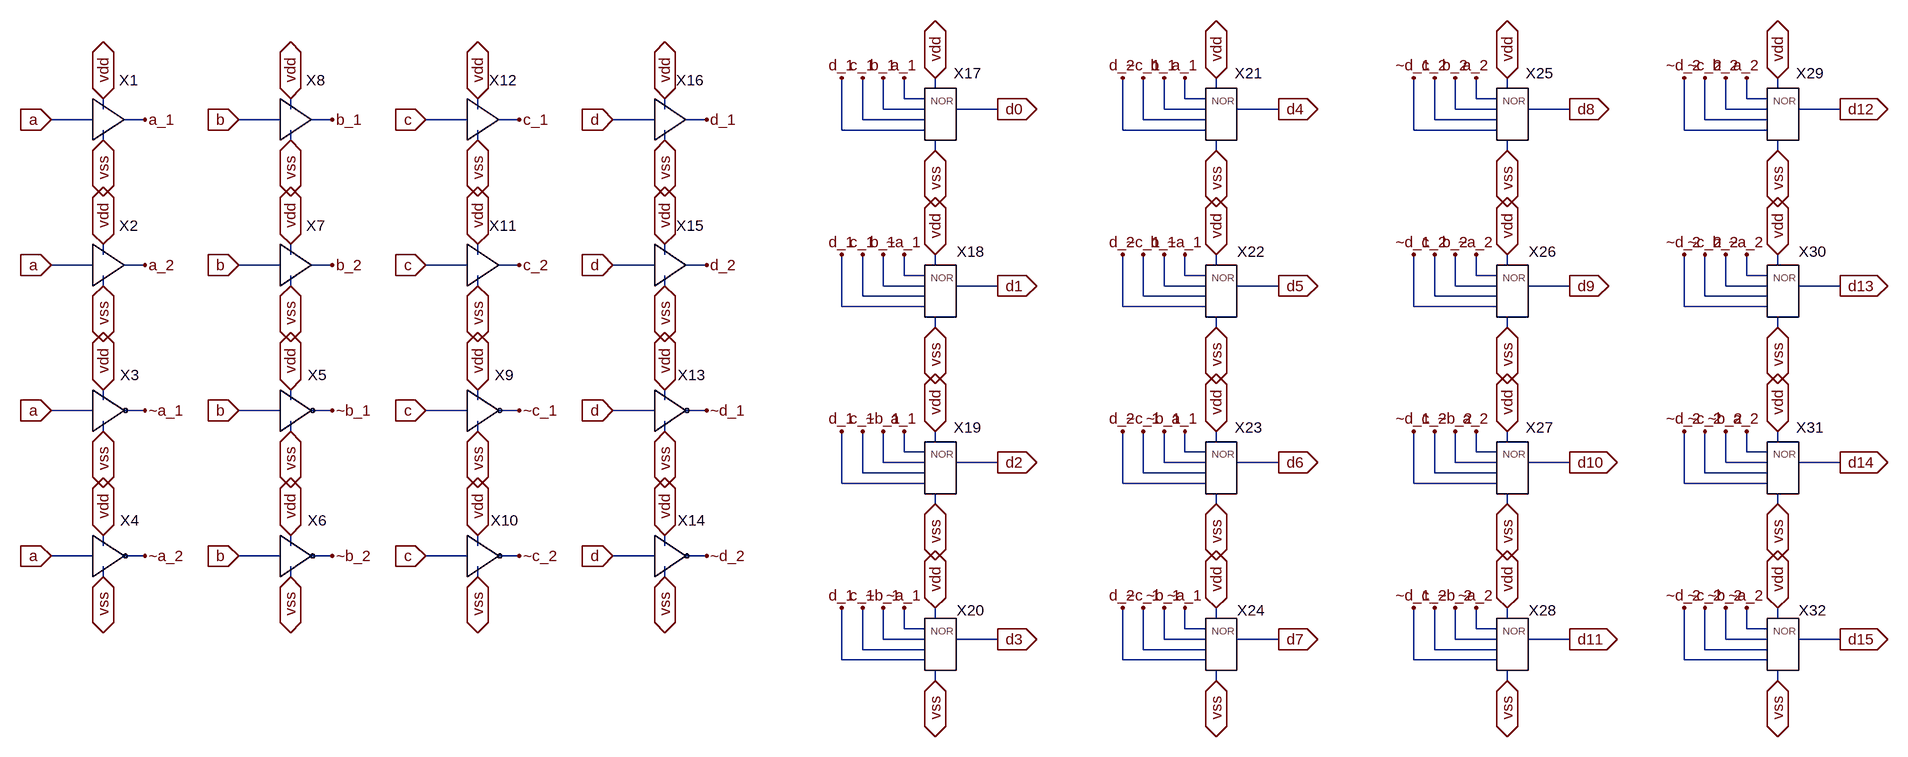
[diagram p0: schematic 4_to_16_decoder.asc]
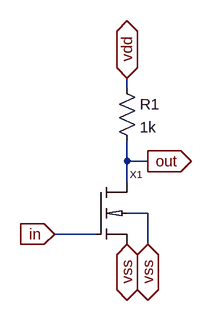
[diagram p1: sub-circuit not.asc]
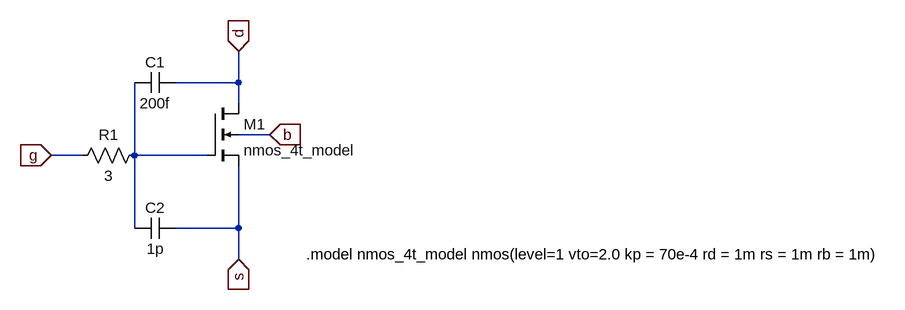
[diagram p2: sub-circuit nmos_4t.asc]
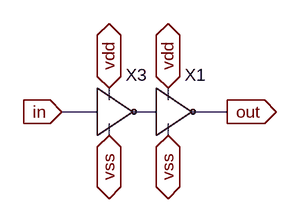
[diagram p3: sub-circuit buffer.asc]
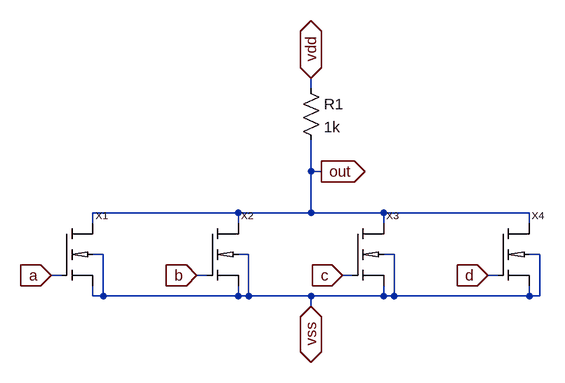
[diagram p4: sub-circuit 4_way_nor.asc]
4_to_16_decoder.asc, the LTspice schematic file:
Version 4
SHEET 1 3944 3300
WIRE 1824 -384 1824 -400
WIRE 2256 -384 2256 -400
WIRE 2704 -384 2704 -400
WIRE 3120 -384 3120 -400
WIRE 1776 -368 1776 -400
WIRE 1808 -368 1776 -368
WIRE 2208 -368 2208 -400
WIRE 2240 -368 2208 -368
WIRE 2656 -368 2656 -400
WIRE 2688 -368 2656 -368
WIRE 3072 -368 3072 -400
WIRE 3104 -368 3072 -368
WIRE 544 -352 544 -368
WIRE 832 -352 832 -368
WIRE 1120 -352 1120 -368
WIRE 1408 -352 1408 -368
WIRE 1744 -352 1744 -400
WIRE 1808 -352 1744 -352
WIRE 1920 -352 1856 -352
WIRE 2176 -352 2176 -400
WIRE 2240 -352 2176 -352
WIRE 2352 -352 2288 -352
WIRE 2624 -352 2624 -400
WIRE 2688 -352 2624 -352
WIRE 2800 -352 2736 -352
WIRE 3040 -352 3040 -400
WIRE 3104 -352 3040 -352
WIRE 3216 -352 3152 -352
WIRE 528 -336 464 -336
WIRE 608 -336 576 -336
WIRE 816 -336 752 -336
WIRE 896 -336 864 -336
WIRE 1104 -336 1040 -336
WIRE 1184 -336 1152 -336
WIRE 1392 -336 1328 -336
WIRE 1472 -336 1440 -336
WIRE 1712 -336 1712 -400
WIRE 1808 -336 1712 -336
WIRE 2144 -336 2144 -400
WIRE 2240 -336 2144 -336
WIRE 2592 -336 2592 -400
WIRE 2688 -336 2592 -336
WIRE 3008 -336 3008 -400
WIRE 3104 -336 3008 -336
WIRE 1680 -320 1680 -400
WIRE 1808 -320 1680 -320
WIRE 2112 -320 2112 -400
WIRE 2240 -320 2112 -320
WIRE 2560 -320 2560 -400
WIRE 2688 -320 2560 -320
WIRE 2976 -320 2976 -400
WIRE 3104 -320 2976 -320
WIRE 544 -304 544 -320
WIRE 832 -304 832 -320
WIRE 1120 -304 1120 -320
WIRE 1408 -304 1408 -320
WIRE 1824 -288 1824 -304
WIRE 2256 -288 2256 -304
WIRE 2704 -288 2704 -304
WIRE 3120 -288 3120 -304
WIRE 544 -128 544 -144
WIRE 832 -128 832 -144
WIRE 1120 -128 1120 -144
WIRE 1408 -128 1408 -144
WIRE 528 -112 464 -112
WIRE 608 -112 576 -112
WIRE 816 -112 752 -112
WIRE 896 -112 864 -112
WIRE 1104 -112 1040 -112
WIRE 1184 -112 1152 -112
WIRE 1392 -112 1328 -112
WIRE 1472 -112 1440 -112
WIRE 1824 -112 1824 -128
WIRE 2256 -112 2256 -128
WIRE 2704 -112 2704 -128
WIRE 3120 -112 3120 -128
WIRE 1776 -96 1776 -128
WIRE 1808 -96 1776 -96
WIRE 2208 -96 2208 -128
WIRE 2240 -96 2208 -96
WIRE 2656 -96 2656 -128
WIRE 2688 -96 2656 -96
WIRE 3072 -96 3072 -128
WIRE 3104 -96 3072 -96
WIRE 544 -80 544 -96
WIRE 832 -80 832 -96
WIRE 1120 -80 1120 -96
WIRE 1408 -80 1408 -96
WIRE 1744 -80 1744 -128
WIRE 1808 -80 1744 -80
WIRE 1920 -80 1856 -80
WIRE 2176 -80 2176 -128
WIRE 2240 -80 2176 -80
WIRE 2352 -80 2288 -80
WIRE 2624 -80 2624 -128
WIRE 2688 -80 2624 -80
WIRE 2800 -80 2736 -80
WIRE 3040 -80 3040 -128
WIRE 3104 -80 3040 -80
WIRE 3216 -80 3152 -80
WIRE 1712 -64 1712 -128
WIRE 1808 -64 1712 -64
WIRE 2144 -64 2144 -128
WIRE 2240 -64 2144 -64
WIRE 2592 -64 2592 -128
WIRE 2688 -64 2592 -64
WIRE 3008 -64 3008 -128
WIRE 3104 -64 3008 -64
WIRE 1680 -48 1680 -128
WIRE 1808 -48 1680 -48
WIRE 2112 -48 2112 -128
WIRE 2240 -48 2112 -48
WIRE 2560 -48 2560 -128
WIRE 2688 -48 2560 -48
WIRE 2976 -48 2976 -128
WIRE 3104 -48 2976 -48
WIRE 1824 -16 1824 -32
WIRE 2256 -16 2256 -32
WIRE 2704 -16 2704 -32
WIRE 3120 -16 3120 -32
WIRE 544 96 544 80
WIRE 832 96 832 80
WIRE 1120 96 1120 80
WIRE 1408 96 1408 80
WIRE 528 112 464 112
WIRE 608 112 576 112
WIRE 816 112 752 112
WIRE 896 112 864 112
WIRE 1104 112 1040 112
WIRE 1184 112 1152 112
WIRE 1392 112 1328 112
WIRE 1472 112 1440 112
WIRE 544 144 544 128
WIRE 832 144 832 128
WIRE 1120 144 1120 128
WIRE 1408 144 1408 128
WIRE 1824 160 1824 144
WIRE 2256 160 2256 144
WIRE 2704 160 2704 144
WIRE 3120 160 3120 144
WIRE 1776 176 1776 144
WIRE 1808 176 1776 176
WIRE 2208 176 2208 144
WIRE 2240 176 2208 176
WIRE 2656 176 2656 144
WIRE 2688 176 2656 176
WIRE 3072 176 3072 144
WIRE 3104 176 3072 176
WIRE 1744 192 1744 144
WIRE 1808 192 1744 192
WIRE 1920 192 1856 192
WIRE 2176 192 2176 144
WIRE 2240 192 2176 192
WIRE 2352 192 2288 192
WIRE 2624 192 2624 144
WIRE 2688 192 2624 192
WIRE 2800 192 2736 192
WIRE 3040 192 3040 144
WIRE 3104 192 3040 192
WIRE 3216 192 3152 192
WIRE 1712 208 1712 144
WIRE 1808 208 1712 208
WIRE 2144 208 2144 144
WIRE 2240 208 2144 208
WIRE 2592 208 2592 144
WIRE 2688 208 2592 208
WIRE 3008 208 3008 144
WIRE 3104 208 3008 208
WIRE 1680 224 1680 144
WIRE 1808 224 1680 224
WIRE 2112 224 2112 144
WIRE 2240 224 2112 224
WIRE 2560 224 2560 144
WIRE 2688 224 2560 224
WIRE 2976 224 2976 144
WIRE 3104 224 2976 224
WIRE 1824 256 1824 240
WIRE 2256 256 2256 240
WIRE 2704 256 2704 240
WIRE 3120 256 3120 240
WIRE 544 320 544 304
WIRE 832 320 832 304
WIRE 1120 320 1120 304
WIRE 1408 320 1408 304
WIRE 528 336 464 336
WIRE 608 336 576 336
WIRE 816 336 752 336
WIRE 896 336 864 336
WIRE 1104 336 1040 336
WIRE 1184 336 1152 336
WIRE 1392 336 1328 336
WIRE 1472 336 1440 336
WIRE 544 368 544 352
WIRE 832 368 832 352
WIRE 1120 368 1120 352
WIRE 1408 368 1408 352
WIRE 1824 432 1824 416
WIRE 2256 432 2256 416
WIRE 2704 432 2704 416
WIRE 3120 432 3120 416
WIRE 1776 448 1776 416
WIRE 1808 448 1776 448
WIRE 2208 448 2208 416
WIRE 2240 448 2208 448
WIRE 2656 448 2656 416
WIRE 2688 448 2656 448
WIRE 3072 448 3072 416
WIRE 3104 448 3072 448
WIRE 1744 464 1744 416
WIRE 1808 464 1744 464
WIRE 1920 464 1856 464
WIRE 2176 464 2176 416
WIRE 2240 464 2176 464
WIRE 2352 464 2288 464
WIRE 2624 464 2624 416
WIRE 2688 464 2624 464
WIRE 2800 464 2736 464
WIRE 3040 464 3040 416
WIRE 3104 464 3040 464
WIRE 3216 464 3152 464
WIRE 1712 480 1712 416
WIRE 1808 480 1712 480
WIRE 2144 480 2144 416
WIRE 2240 480 2144 480
WIRE 2592 480 2592 416
WIRE 2688 480 2592 480
WIRE 3008 480 3008 416
WIRE 3104 480 3008 480
WIRE 1680 496 1680 416
WIRE 1808 496 1680 496
WIRE 2112 496 2112 416
WIRE 2240 496 2112 496
WIRE 2560 496 2560 416
WIRE 2688 496 2560 496
WIRE 2976 496 2976 416
WIRE 3104 496 2976 496
WIRE 1824 528 1824 512
WIRE 2256 528 2256 512
WIRE 2704 528 2704 512
WIRE 3120 528 3120 512
FLAG 464 112 a
IOPIN 464 112 In
FLAG 544 80 vdd
IOPIN 544 80 BiDir
FLAG 544 144 vss
IOPIN 544 144 BiDir
FLAG 608 112 ~a_1
FLAG 464 336 a
IOPIN 464 336 In
FLAG 544 304 vdd
IOPIN 544 304 BiDir
FLAG 544 368 vss
IOPIN 544 368 BiDir
FLAG 608 336 ~a_2
FLAG 464 -112 a
IOPIN 464 -112 In
FLAG 544 -144 vdd
IOPIN 544 -144 BiDir
FLAG 544 -80 vss
IOPIN 544 -80 BiDir
FLAG 608 -112 a_2
FLAG 464 -336 a
IOPIN 464 -336 In
FLAG 544 -368 vdd
IOPIN 544 -368 BiDir
FLAG 544 -304 vss
IOPIN 544 -304 BiDir
FLAG 608 -336 a_1
FLAG 832 80 vdd
IOPIN 832 80 BiDir
FLAG 832 144 vss
IOPIN 832 144 BiDir
FLAG 896 112 ~b_1
FLAG 832 304 vdd
IOPIN 832 304 BiDir
FLAG 832 368 vss
IOPIN 832 368 BiDir
FLAG 896 336 ~b_2
FLAG 832 -144 vdd
IOPIN 832 -144 BiDir
FLAG 832 -80 vss
IOPIN 832 -80 BiDir
FLAG 896 -112 b_2
FLAG 752 -336 b
IOPIN 752 -336 In
FLAG 832 -368 vdd
IOPIN 832 -368 BiDir
FLAG 832 -304 vss
IOPIN 832 -304 BiDir
FLAG 896 -336 b_1
FLAG 752 -112 b
IOPIN 752 -112 In
FLAG 752 112 b
IOPIN 752 112 In
FLAG 752 336 b
IOPIN 752 336 In
FLAG 1120 80 vdd
IOPIN 1120 80 BiDir
FLAG 1120 144 vss
IOPIN 1120 144 BiDir
FLAG 1184 112 ~c_1
FLAG 1120 304 vdd
IOPIN 1120 304 BiDir
FLAG 1120 368 vss
IOPIN 1120 368 BiDir
FLAG 1184 336 ~c_2
FLAG 1120 -144 vdd
IOPIN 1120 -144 BiDir
FLAG 1120 -80 vss
IOPIN 1120 -80 BiDir
FLAG 1184 -112 c_2
FLAG 1040 -336 c
IOPIN 1040 -336 In
FLAG 1120 -368 vdd
IOPIN 1120 -368 BiDir
FLAG 1120 -304 vss
IOPIN 1120 -304 BiDir
FLAG 1184 -336 c_1
FLAG 1040 -112 c
IOPIN 1040 -112 In
FLAG 1040 112 c
IOPIN 1040 112 In
FLAG 1040 336 c
IOPIN 1040 336 In
FLAG 1408 80 vdd
IOPIN 1408 80 BiDir
FLAG 1408 144 vss
IOPIN 1408 144 BiDir
FLAG 1472 112 ~d_1
FLAG 1408 304 vdd
IOPIN 1408 304 BiDir
FLAG 1408 368 vss
IOPIN 1408 368 BiDir
FLAG 1472 336 ~d_2
FLAG 1408 -144 vdd
IOPIN 1408 -144 BiDir
FLAG 1408 -80 vss
IOPIN 1408 -80 BiDir
FLAG 1472 -112 d_2
FLAG 1328 -336 d
IOPIN 1328 -336 In
FLAG 1408 -368 vdd
IOPIN 1408 -368 BiDir
FLAG 1408 -304 vss
IOPIN 1408 -304 BiDir
FLAG 1472 -336 d_1
FLAG 1328 -112 d
IOPIN 1328 -112 In
FLAG 1328 112 d
IOPIN 1328 112 In
FLAG 1328 336 d
IOPIN 1328 336 In
FLAG 1920 -352 d0
IOPIN 1920 -352 Out
FLAG 1920 -80 d1
IOPIN 1920 -80 Out
FLAG 1920 464 d3
IOPIN 1920 464 Out
FLAG 1920 192 d2
IOPIN 1920 192 Out
FLAG 2352 -352 d4
IOPIN 2352 -352 Out
FLAG 2352 -80 d5
IOPIN 2352 -80 Out
FLAG 2352 192 d6
IOPIN 2352 192 Out
FLAG 2352 464 d7
IOPIN 2352 464 Out
FLAG 2800 -352 d8
IOPIN 2800 -352 Out
FLAG 2800 -80 d9
IOPIN 2800 -80 Out
FLAG 2800 192 d10
IOPIN 2800 192 Out
FLAG 2800 464 d11
IOPIN 2800 464 Out
FLAG 3216 -352 d12
IOPIN 3216 -352 Out
FLAG 3216 -80 d13
IOPIN 3216 -80 Out
FLAG 3216 192 d14
IOPIN 3216 192 Out
FLAG 3216 464 d15
IOPIN 3216 464 Out
FLAG 1824 -288 vss
IOPIN 1824 -288 BiDir
FLAG 1824 144 vdd
IOPIN 1824 144 BiDir
FLAG 1824 256 vss
IOPIN 1824 256 BiDir
FLAG 1824 416 vdd
IOPIN 1824 416 BiDir
FLAG 1824 528 vss
IOPIN 1824 528 BiDir
FLAG 1824 -400 vdd
IOPIN 1824 -400 BiDir
FLAG 1776 -400 a_1
FLAG 1744 -400 b_1
FLAG 1712 -400 c_1
FLAG 1680 -400 d_1
FLAG 1824 -16 vss
IOPIN 1824 -16 BiDir
FLAG 1824 -128 vdd
IOPIN 1824 -128 BiDir
FLAG 1776 -128 ~a_1
FLAG 1744 -128 b_1
FLAG 1712 -128 c_1
FLAG 1680 -128 d_1
FLAG 1776 144 a_1
FLAG 1744 144 ~b_1
FLAG 1712 144 c_1
FLAG 1680 144 d_1
FLAG 1776 416 ~a_1
FLAG 1744 416 ~b_1
FLAG 1712 416 c_1
FLAG 1680 416 d_1
FLAG 2256 -288 vss
IOPIN 2256 -288 BiDir
FLAG 2256 144 vdd
IOPIN 2256 144 BiDir
FLAG 2256 256 vss
IOPIN 2256 256 BiDir
FLAG 2256 416 vdd
IOPIN 2256 416 BiDir
FLAG 2256 528 vss
IOPIN 2256 528 BiDir
FLAG 2256 -400 vdd
IOPIN 2256 -400 BiDir
FLAG 2208 -400 a_1
FLAG 2176 -400 b_1
FLAG 2144 -400 ~c_1
FLAG 2112 -400 d_2
FLAG 2256 -16 vss
IOPIN 2256 -16 BiDir
FLAG 2256 -128 vdd
IOPIN 2256 -128 BiDir
FLAG 2208 -128 ~a_1
FLAG 2176 -128 b_1
FLAG 2144 -128 ~c_1
FLAG 2112 -128 d_2
FLAG 2208 144 a_1
FLAG 2176 144 ~b_1
FLAG 2144 144 ~c_1
FLAG 2112 144 d_2
FLAG 2208 416 ~a_1
FLAG 2176 416 ~b_1
FLAG 2144 416 ~c_1
FLAG 2112 416 d_2
FLAG 2704 -288 vss
IOPIN 2704 -288 BiDir
FLAG 2704 144 vdd
IOPIN 2704 144 BiDir
FLAG 2704 256 vss
IOPIN 2704 256 BiDir
FLAG 2704 416 vdd
IOPIN 2704 416 BiDir
FLAG 2704 528 vss
IOPIN 2704 528 BiDir
FLAG 2704 -400 vdd
IOPIN 2704 -400 BiDir
FLAG 2656 -400 a_2
FLAG 2624 -400 b_2
FLAG 2592 -400 c_2
FLAG 2560 -400 ~d_1
FLAG 2704 -16 vss
IOPIN 2704 -16 BiDir
FLAG 2704 -128 vdd
IOPIN 2704 -128 BiDir
FLAG 3120 -288 vss
IOPIN 3120 -288 BiDir
FLAG 3120 144 vdd
IOPIN 3120 144 BiDir
FLAG 3120 256 vss
IOPIN 3120 256 BiDir
FLAG 3120 416 vdd
IOPIN 3120 416 BiDir
FLAG 3120 528 vss
IOPIN 3120 528 BiDir
FLAG 3120 -400 vdd
IOPIN 3120 -400 BiDir
FLAG 3120 -16 vss
IOPIN 3120 -16 BiDir
FLAG 3120 -128 vdd
IOPIN 3120 -128 BiDir
FLAG 2656 -128 ~a_2
FLAG 2624 -128 b_2
FLAG 2592 -128 c_2
FLAG 2560 -128 ~d_1
FLAG 2656 144 a_2
FLAG 2624 144 ~b_2
FLAG 2592 144 c_2
FLAG 2560 144 ~d_1
FLAG 2656 416 ~a_2
FLAG 2624 416 ~b_2
FLAG 2592 416 c_2
FLAG 2560 416 ~d_1
FLAG 3072 -400 a_2
FLAG 3040 -400 b_2
FLAG 3008 -400 ~c_2
FLAG 2976 -400 ~d_2
FLAG 3072 -128 ~a_2
FLAG 3040 -128 b_2
FLAG 3008 -128 ~c_2
FLAG 2976 -128 ~d_2
FLAG 3072 144 a_2
FLAG 3040 144 ~b_2
FLAG 3008 144 ~c_2
FLAG 2976 144 ~d_2
FLAG 3072 416 ~a_2
FLAG 3040 416 ~b_2
FLAG 3008 416 ~c_2
FLAG 2976 416 ~d_2
SYMBOL not 528 112 R0
WINDOW 0 57 -39 Bottom 2
SYMATTR InstName X3
SYMBOL not 528 336 R0
WINDOW 0 57 -39 Bottom 2
SYMATTR InstName X4
SYMBOL buffer 528 -112 R0
WINDOW 0 55 -45 Bottom 2
SYMATTR InstName X2
SYMBOL buffer 528 -336 R0
WINDOW 0 55 -45 Bottom 2
SYMATTR InstName X1
SYMBOL not 816 112 R0
WINDOW 0 57 -39 Bottom 2
SYMATTR InstName X5
SYMBOL not 816 336 R0
WINDOW 0 57 -39 Bottom 2
SYMATTR InstName X6
SYMBOL buffer 816 -112 R0
WINDOW 0 55 -45 Bottom 2
SYMATTR InstName X7
SYMBOL buffer 816 -336 R0
WINDOW 0 55 -45 Bottom 2
SYMATTR InstName X8
SYMBOL not 1104 112 R0
WINDOW 0 57 -39 Bottom 2
SYMATTR InstName X9
SYMBOL not 1104 336 R0
WINDOW 0 57 -39 Bottom 2
SYMATTR InstName X10
SYMBOL buffer 1104 -112 R0
WINDOW 0 55 -45 Bottom 2
SYMATTR InstName X11
SYMBOL buffer 1104 -336 R0
WINDOW 0 55 -45 Bottom 2
SYMATTR InstName X12
SYMBOL not 1392 112 R0
WINDOW 0 57 -39 Bottom 2
SYMATTR InstName X13
SYMBOL not 1392 336 R0
WINDOW 0 57 -39 Bottom 2
SYMATTR InstName X14
SYMBOL buffer 1392 -112 R0
WINDOW 0 55 -45 Bottom 2
SYMATTR InstName X15
SYMBOL buffer 1392 -336 R0
WINDOW 0 55 -45 Bottom 2
SYMATTR InstName X16
SYMBOL 4_way_nor 1840 -352 R0
WINDOW 0 34 -40 Bottom 2
SYMATTR InstName X17
SYMBOL 4_way_nor 1840 -80 R0
WINDOW 0 38 -37 Bottom 2
SYMATTR InstName X18
SYMBOL 4_way_nor 1840 192 R0
WINDOW 0 34 -38 Bottom 2
SYMATTR InstName X19
SYMBOL 4_way_nor 1840 464 R0
WINDOW 0 38 -29 Bottom 2
SYMATTR InstName X20
SYMBOL 4_way_nor 2272 -352 R0
WINDOW 0 34 -40 Bottom 2
SYMATTR InstName X21
SYMBOL 4_way_nor 2272 -80 R0
WINDOW 0 38 -37 Bottom 2
SYMATTR InstName X22
SYMBOL 4_way_nor 2272 192 R0
WINDOW 0 34 -38 Bottom 2
SYMATTR InstName X23
SYMBOL 4_way_nor 2272 464 R0
WINDOW 0 38 -29 Bottom 2
SYMATTR InstName X24
SYMBOL 4_way_nor 2720 -352 R0
WINDOW 0 34 -40 Bottom 2
SYMATTR InstName X25
SYMBOL 4_way_nor 2720 -80 R0
WINDOW 0 38 -37 Bottom 2
SYMATTR InstName X26
SYMBOL 4_way_nor 2720 192 R0
WINDOW 0 34 -38 Bottom 2
SYMATTR InstName X27
SYMBOL 4_way_nor 2720 464 R0
WINDOW 0 38 -29 Bottom 2
SYMATTR InstName X28
SYMBOL 4_way_nor 3136 -352 R0
WINDOW 0 34 -40 Bottom 2
SYMATTR InstName X29
SYMBOL 4_way_nor 3136 -80 R0
WINDOW 0 38 -37 Bottom 2
SYMATTR InstName X30
SYMBOL 4_way_nor 3136 192 R0
WINDOW 0 34 -38 Bottom 2
SYMATTR InstName X31
SYMBOL 4_way_nor 3136 464 R0
WINDOW 0 38 -29 Bottom 2
SYMATTR InstName X32

not.asc, the sub-circuit schematic file:
Version 4
SHEET 1 880 680
WIRE 176 -96 176 -112
WIRE 176 16 176 -16
WIRE 208 16 176 16
WIRE 176 48 176 16
WIRE 208 96 176 96
WIRE 128 128 64 128
WIRE 208 144 208 96
FLAG 64 128 in
IOPIN 64 128 In
FLAG 176 144 vss
IOPIN 176 144 BiDir
FLAG 176 -112 vdd
IOPIN 176 -112 BiDir
FLAG 208 16 out
IOPIN 208 16 Out
FLAG 208 144 vss
IOPIN 208 144 BiDir
SYMBOL res 160 -112 R0
SYMATTR InstName R1
SYMATTR Value 1k
SYMBOL nmos_4t 128 48 R0
SYMATTR InstName X1

nmos_4t.asc, the sub-circuit schematic file:
Version 4
SHEET 1 880 680
WIRE -288 -224 -288 -272
WIRE -288 -224 -384 -224
WIRE -288 -192 -288 -224
WIRE -240 -144 -288 -144
WIRE -528 -112 -576 -112
WIRE -448 -112 -448 -224
WIRE -336 -112 -448 -112
WIRE -448 0 -448 -112
WIRE -288 0 -288 -96
WIRE -288 0 -384 0
WIRE -288 48 -288 0
FLAG -576 -112 g
IOPIN -576 -112 In
FLAG -288 -272 d
IOPIN -288 -272 In
FLAG -288 48 s
IOPIN -288 48 In
FLAG -240 -144 b
IOPIN -240 -144 In
SYMBOL nmos4 -336 -192 R0
SYMATTR InstName M1
SYMATTR Value nmos_4t_model
SYMBOL cap -384 -240 R90
WINDOW 0 0 32 VBottom 2
WINDOW 3 32 32 VTop 2
SYMATTR InstName C1
SYMATTR Value 200f
SYMBOL cap -384 -16 R90
WINDOW 0 0 32 VBottom 2
WINDOW 3 32 32 VTop 2
SYMATTR InstName C2
SYMATTR Value 1p
SYMBOL res -432 -128 R90
WINDOW 0 0 56 VBottom 2
WINDOW 3 32 56 VTop 2
SYMATTR InstName R1
SYMATTR Value 3
TEXT -184 40 Left 2 !.model nmos_4t_model nmos(level=1 vto=2.0 kp = 70e-4 rd = 1m rs = 1m rb = 1m)

buffer.asc, the sub-circuit schematic file:
Version 4
SHEET 1 880 680
WIRE -48 48 -48 32
WIRE 32 48 32 32
WIRE -64 64 -112 64
WIRE 16 64 -16 64
WIRE 112 64 64 64
WIRE -48 96 -48 80
WIRE 32 96 32 80
FLAG -112 64 in
IOPIN -112 64 In
FLAG -48 32 vdd
IOPIN -48 32 BiDir
FLAG 112 64 out
IOPIN 112 64 Out
FLAG -48 96 vss
IOPIN -48 96 BiDir
FLAG 32 96 vss
IOPIN 32 96 BiDir
FLAG 32 32 vdd
IOPIN 32 32 BiDir
SYMBOL not -64 64 R0
WINDOW 0 53 -34 Bottom 2
SYMATTR InstName X3
SYMBOL not 16 64 R0
WINDOW 0 53 -34 Bottom 2
SYMATTR InstName X1

4_way_nor.asc, the sub-circuit schematic file:
Version 4
SHEET 1 1112 680
WIRE 464 208 464 192
WIRE 464 336 464 288
WIRE 480 336 464 336
WIRE 352 400 128 400
WIRE 464 400 464 336
WIRE 464 400 352 400
WIRE 576 400 464 400
WIRE 800 400 576 400
WIRE 128 416 128 400
WIRE 352 416 352 400
WIRE 576 416 576 400
WIRE 800 416 800 400
WIRE 144 464 128 464
WIRE 368 464 352 464
WIRE 592 464 576 464
WIRE 816 464 800 464
WIRE 80 496 64 496
WIRE 304 496 288 496
WIRE 528 496 512 496
WIRE 752 496 736 496
WIRE 128 528 128 512
WIRE 144 528 144 464
WIRE 144 528 128 528
WIRE 352 528 352 512
WIRE 352 528 144 528
WIRE 368 528 368 464
WIRE 368 528 352 528
WIRE 464 528 368 528
WIRE 576 528 576 512
WIRE 576 528 464 528
WIRE 592 528 592 464
WIRE 592 528 576 528
WIRE 800 528 800 512
WIRE 800 528 592 528
WIRE 816 528 816 464
WIRE 816 528 800 528
WIRE 464 544 464 528
FLAG 464 192 vdd
IOPIN 464 192 BiDir
FLAG 464 544 vss
IOPIN 464 544 BiDir
FLAG 288 496 b
IOPIN 288 496 In
FLAG 64 496 a
IOPIN 64 496 In
FLAG 736 496 d
IOPIN 736 496 In
FLAG 512 496 c
IOPIN 512 496 In
FLAG 480 336 out
IOPIN 480 336 Out
SYMBOL res 448 192 R0
SYMATTR InstName R1
SYMATTR Value 1k
SYMBOL nmos_4t 80 416 R0
SYMATTR InstName X1
SYMBOL nmos_4t 304 416 R0
SYMATTR InstName X2
SYMBOL nmos_4t 528 416 R0
SYMATTR InstName X3
SYMBOL nmos_4t 752 416 R0
SYMATTR InstName X4

The netlist it stands for:
* 4_to_16_decoder.asc
XX3 a ~a_1 vss vdd not
XX4 a ~a_2 vss vdd not
XX2 a a_2 vss vdd buffer
XX1 a a_1 vss vdd buffer
XX5 b ~b_1 vss vdd not
XX6 b ~b_2 vss vdd not
XX7 b b_2 vss vdd buffer
XX8 b b_1 vss vdd buffer
XX9 c ~c_1 vss vdd not
XX10 c ~c_2 vss vdd not
XX11 c c_2 vss vdd buffer
XX12 c c_1 vss vdd buffer
XX13 d ~d_1 vss vdd not
XX14 d ~d_2 vss vdd not
XX15 d d_2 vss vdd buffer
XX16 d d_1 vss vdd buffer
XX17 a_1 b_1 c_1 d_1 d0 vdd vss 4_way_nor
XX18 ~a_1 b_1 c_1 d_1 d1 vdd vss 4_way_nor
XX19 a_1 ~b_1 c_1 d_1 d2 vdd vss 4_way_nor
XX20 ~a_1 ~b_1 c_1 d_1 d3 vdd vss 4_way_nor
XX21 a_1 b_1 ~c_1 d_2 d4 vdd vss 4_way_nor
XX22 ~a_1 b_1 ~c_1 d_2 d5 vdd vss 4_way_nor
XX23 a_1 ~b_1 ~c_1 d_2 d6 vdd vss 4_way_nor
XX24 ~a_1 ~b_1 ~c_1 d_2 d7 vdd vss 4_way_nor
XX25 a_2 b_2 c_2 ~d_1 d8 vdd vss 4_way_nor
XX26 ~a_2 b_2 c_2 ~d_1 d9 vdd vss 4_way_nor
XX27 a_2 ~b_2 c_2 ~d_1 d10 vdd vss 4_way_nor
XX28 ~a_2 ~b_2 c_2 ~d_1 d11 vdd vss 4_way_nor
XX29 a_2 b_2 ~c_2 ~d_2 d12 vdd vss 4_way_nor
XX30 ~a_2 b_2 ~c_2 ~d_2 d13 vdd vss 4_way_nor
XX31 a_2 ~b_2 ~c_2 ~d_2 d14 vdd vss 4_way_nor
XX32 ~a_2 ~b_2 ~c_2 ~d_2 d15 vdd vss 4_way_nor

* block symbol definitions
.subckt not in out vss vdd
R1 vdd out 1k
XX1 out in vss vss nmos_4t
.ends not

.subckt nmos_4t D G S B
M1 d N001 s b nmos_4t_model
C1 d N001 200f
C2 s N001 1p
R1 N001 g 3
.model nmos_4t_model nmos(level=1 vto=2.0 kp = 70e-4 rd = 1m rs = 1m rb = 1m)
.ends nmos_4t

.subckt buffer in out vss vdd
XX3 in N001 vss vdd not
XX1 N001 out vss vdd not
.ends buffer

.subckt 4_way_nor a b c d out vdd vss
R1 vdd out 1k
XX1 out a vss vss nmos_4t
XX2 out b vss vss nmos_4t
XX3 out c vss vss nmos_4t
XX4 out d vss vss nmos_4t
.ends 4_way_nor

.model NMOS NMOS
.model PMOS PMOS
.lib standard.mos
.backanno
.end